# EAGLE design ma700_breakout (EAGLE 6.5.0)
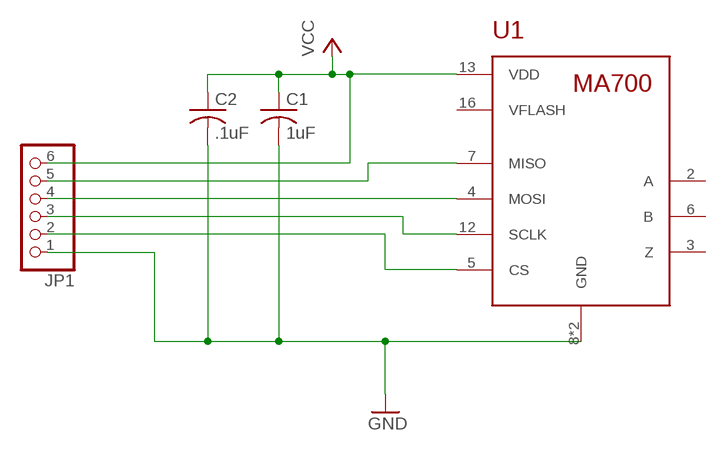
[diagram p0: schematic, sheet 1]

## Parts
C1  1uF  C-USC0603  [C0603]
C2  .1uF  C-USC0603  [C0603]
JP1  PINHD-1X6  [1X06]
U1  MA700  [QFN-16]

## Nets
GND: C1.2 C2.2 JP1.1 U1.8(GND) U1.PAD(GND)
N$2: JP1.2 U1.5(CS)
N$3: JP1.3 U1.12(SCLK)
N$4: JP1.4 U1.4(MOSI)
N$5: JP1.5 U1.7(MISO)
VCC: C1.1 C2.1 JP1.6 U1.13(VDD)
Unconnected: U1.2(A) U1.3(Z) U1.6(B) U1.16(VFLASH)

## Library data of the parts
C1 C2 = rcl:C-US: CAPACITOR, American symbol
JP1 = pinhead:PINHD-1X6: PIN HEADER
U1 = ma700_breakout:MA700

## Net classes
0 default: width 0.203 mm

## Board
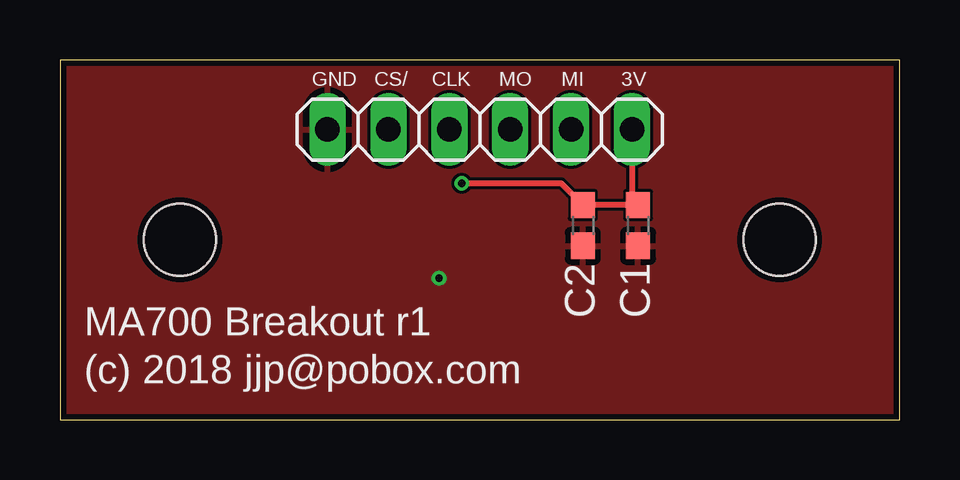
[diagram p1: board, top side]
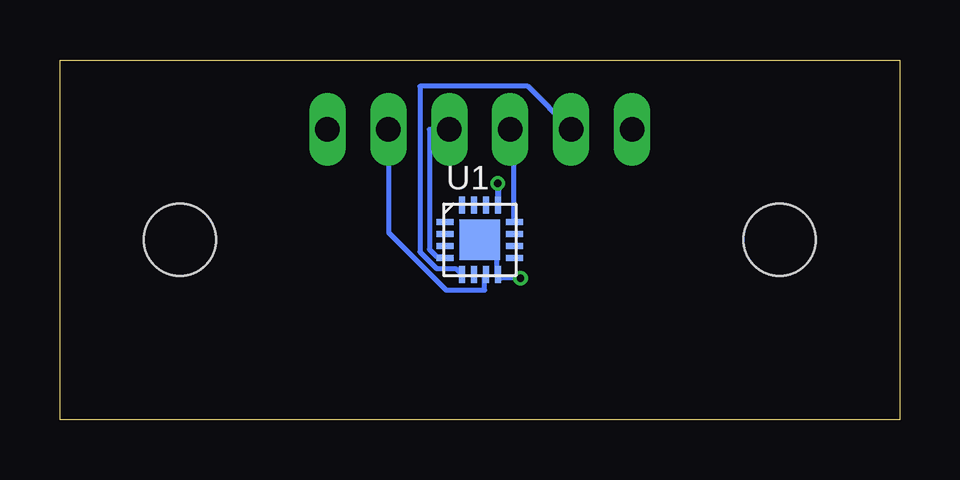
[diagram p2: board, bottom side, seen from below]

Size 35 x 15 mm. Coordinates in mm from the lower left corner, seen from the top.
Outline: 0,0 35,0 35,15 0,15 0,0
Copper layers (1*16): Top 0.035mm / dielectric 1.5mm / Bottom 0.035mm
Design rules "MF_Standard_2_Layer": minimum track width 5mil, minimum drill 12mil, track to track 5mil, track to pad 5mil, pad to pad 5mil, via to via 5mil, smd to smd 0mil, copper to edge 10mil, drill to drill 10mil, minimum pad ring 6mil, minimum via ring 6mil, stop-mask expansion 2mil, vias tented up to drill 25mil, thermal gap 10mil
Holes 3 mm at 5,7.5 30,7.5

### Footprints (pad centres in the part's own frame; a part is rotated, then mirrored left to right if it is on the bottom)
C0603 = smd 1.1 x 1: 1 -0.85,0; 2 0.85,0
1X06 = drill 1.016 long: 1 -6.35,0; 2 -3.81,0; 3 -1.27,0; 4 1.27,0; 5 3.81,0; 6 6.35,0
QFN-16 = smd 0.7 x 0.25: 1 -1.45,0.75; 2 -1.45,0.25; 3 -1.45,-0.25; 4 -1.45,-0.75; 9 1.45,-0.75; 10 1.45,-0.25; 11 1.45,0.25; 12 1.45,0.75 | smd 0.25 x 0.7: 5 -0.75,-1.45; 6 -0.25,-1.45; 7 0.25,-1.45; 8 0.75,-1.45; 13 0.75,1.45; 14 0.25,1.45; 15 -0.25,1.45; 16 -0.75,1.45 | smd 1.7 x 1.7: PAD 0,0

### Placement (x,y rotation side)
C1  24.1,8.1 270 top
C2  21.8,8.1 270 top
JP1  17.5,12.1 0 top
U1  17.5,7.5 0 bottom

### Tracks (layer width: path | path; a pad name or v marks a point on that pad's centre or on a via)
GND  (via drill 0.3)
  Bottom 0.203: v15.8,5.9 16.6,5.9 U1.8 16.8,6.1 16.8,7.5 U1.PAD
  pour Top: 0.3,0.3 34.7,0.3 34.7,14.7 0.3,14.7
N$2
  Bottom 0.203: U1.5 18.5,6.3 19.3,6.3 20,7 20,13.9 15.5,13.9 JP1.2
N$3
  Bottom 0.203: JP1.3 16.1,12.1 16.1,8.3 U1.12
N$4
  Bottom 0.203: JP1.4 19.6,12.1 19.6,7.1 19.3,6.8 19,6.8 U1.4
N$5
  Bottom 0.203: U1.7 17.3,6 17.3,5.4 18.9,5.4 21.3,7.8 JP1.5
VCC  (via drill 0.3)
  Top 0.254: JP1.6 23.85,9.2 C1.1 C2.1 20.9,9.85 v16.75,9.85
  Bottom 0.254: v16.75,9.85 U1.13

### Text on the board
tPlace: GND | CS/ | CLK | MO | MI | 3V | MA700 Breakout r1 | (c) 2018 jjp@pobox.com